# Altium schematic sheet MotorControllerV_Driver1.1.SchDoc
size 889 x 508 mm
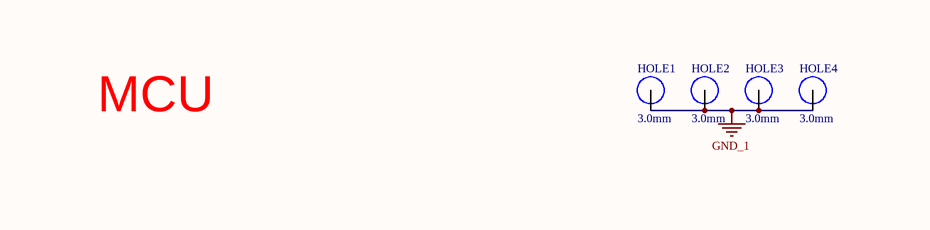
[diagram p0: MotorControllerV_Driver1.1.SchDoc, top left]
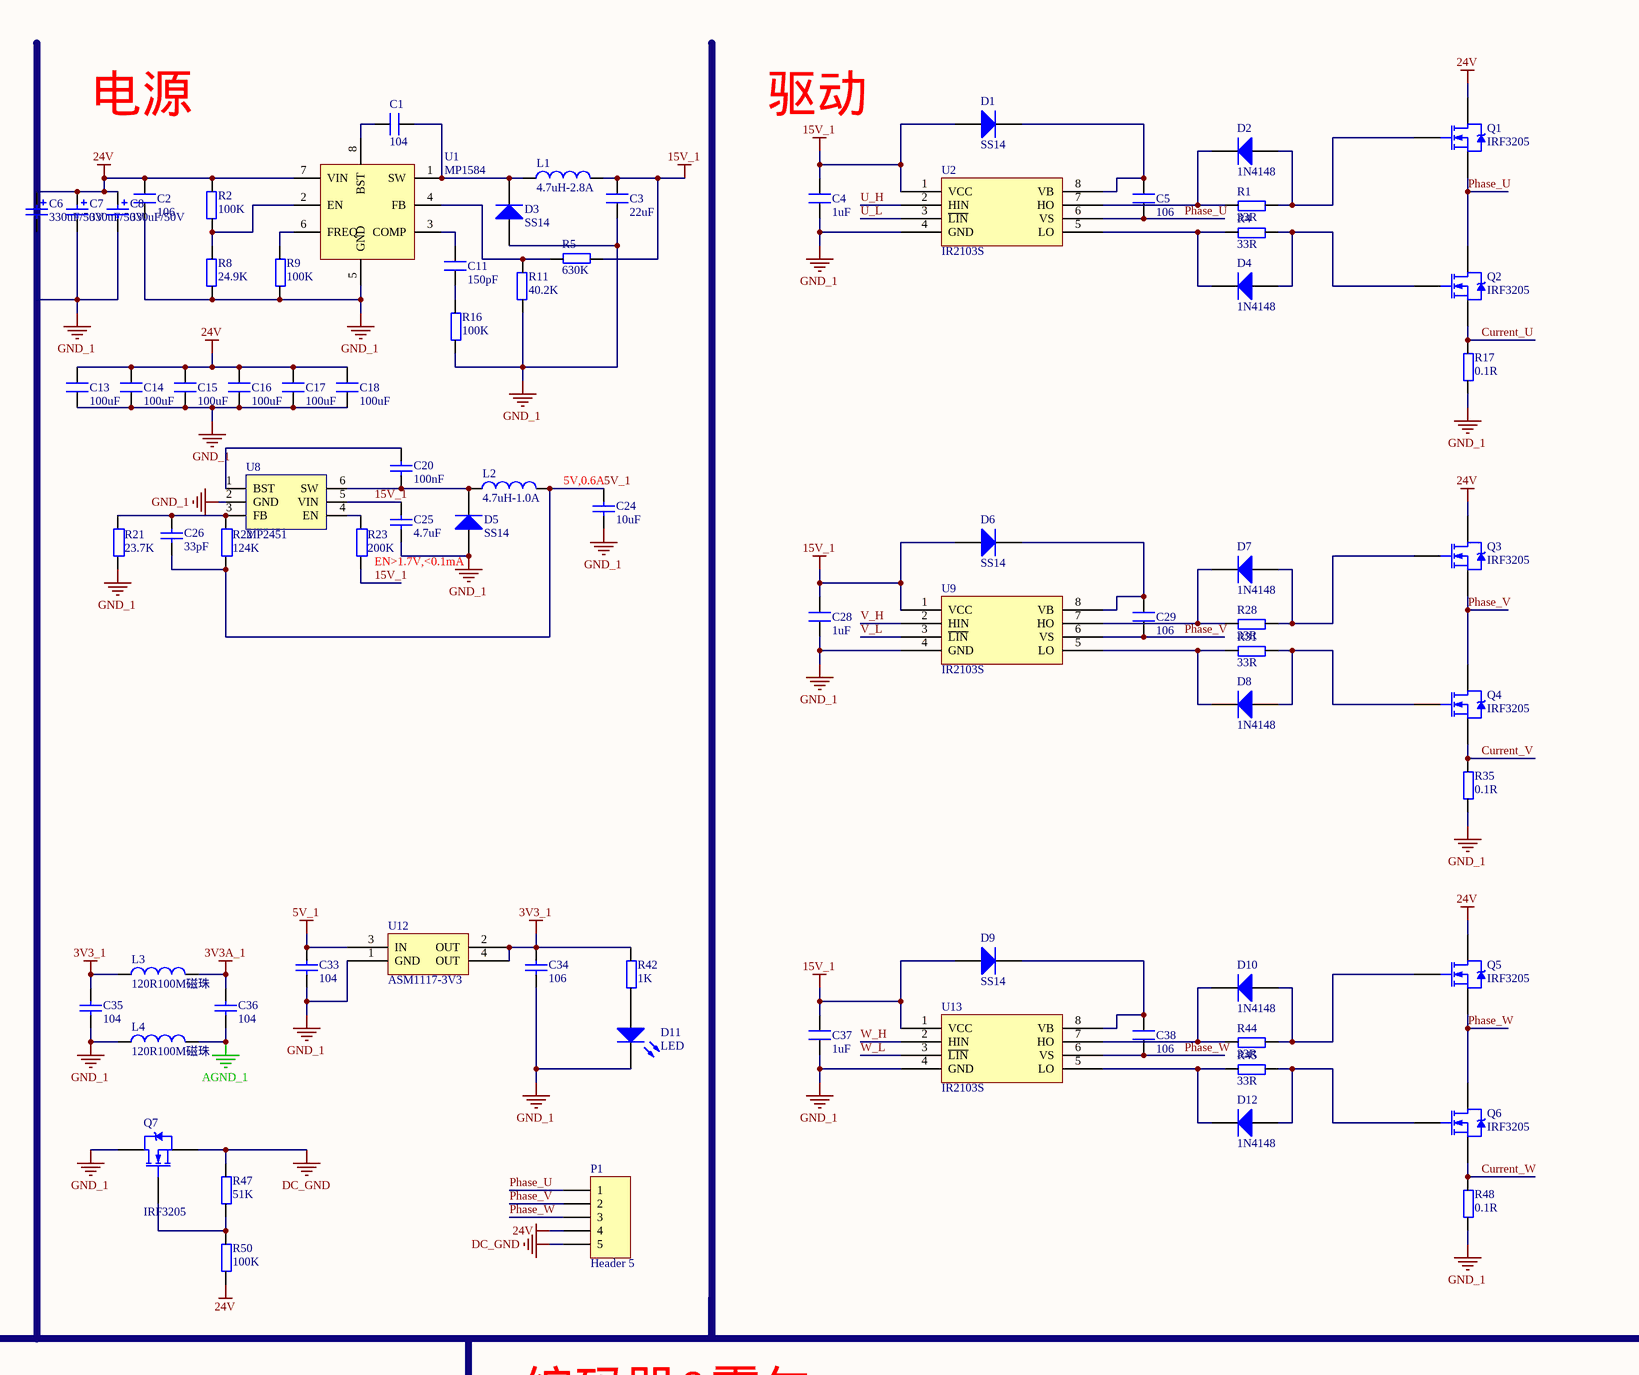
[diagram p1: MotorControllerV_Driver1.1.SchDoc, top middle]
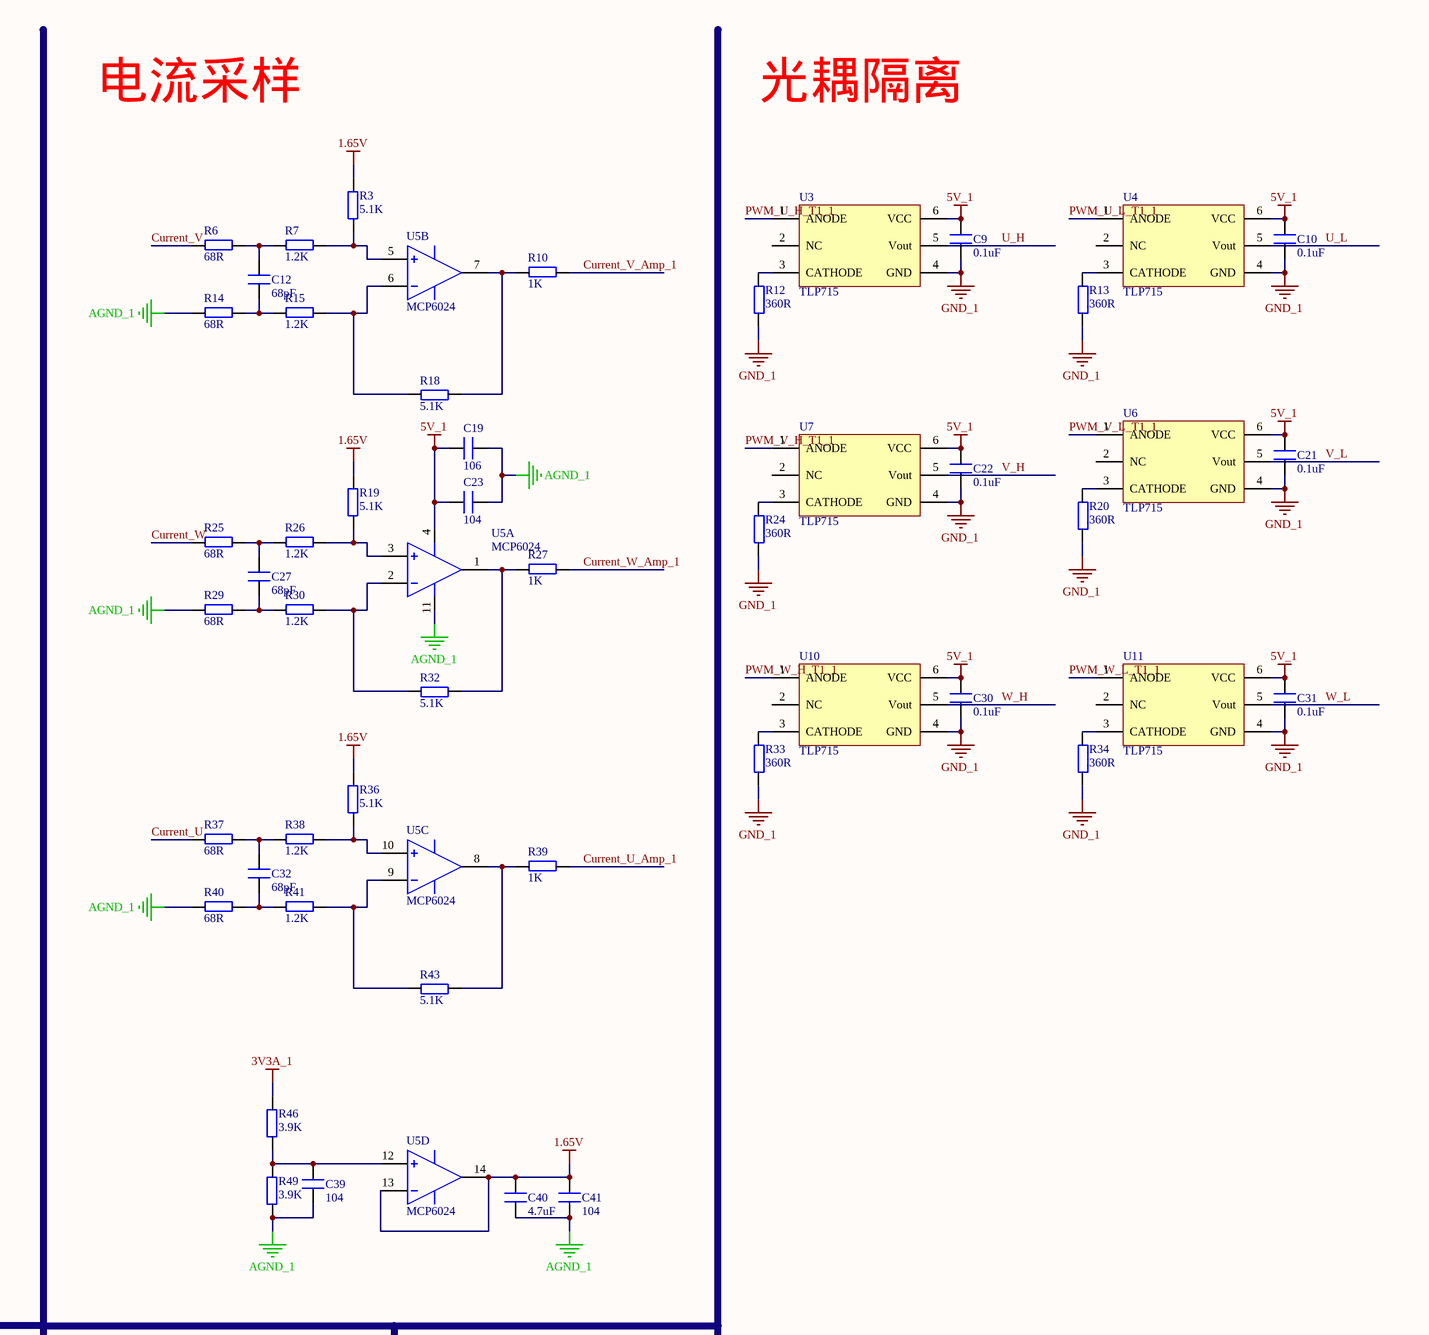
[diagram p2: MotorControllerV_Driver1.1.SchDoc, top right]
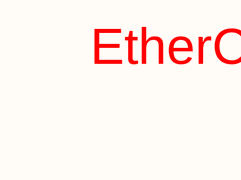
[diagram p3: MotorControllerV_Driver1.1.SchDoc, bottom left]
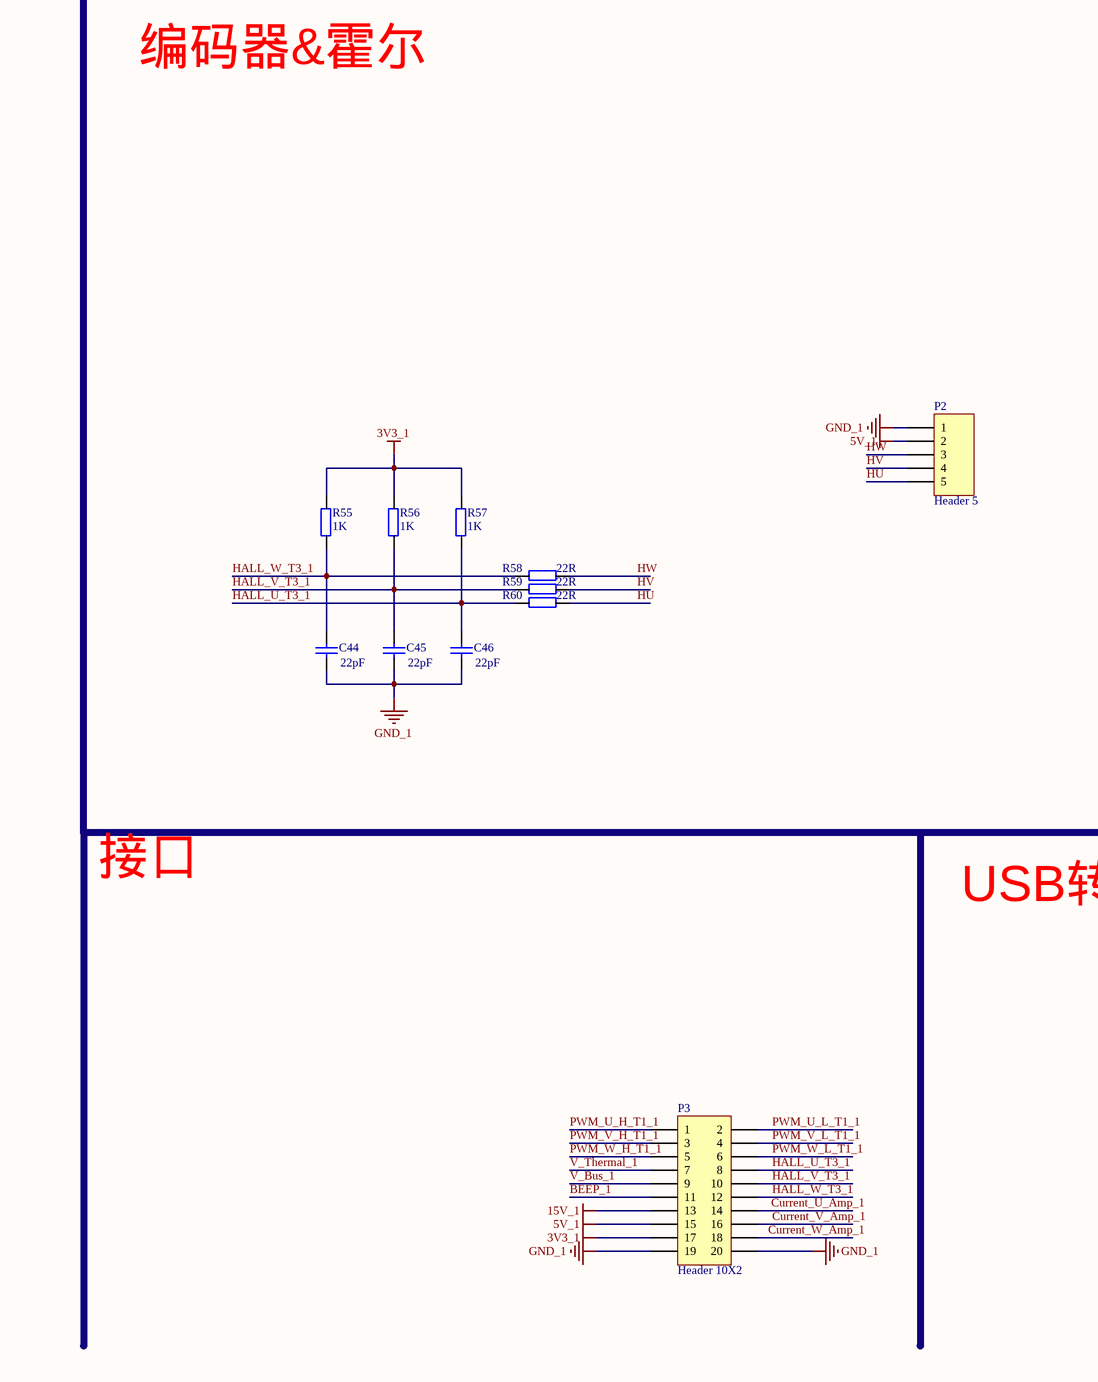
[diagram p4: MotorControllerV_Driver1.1.SchDoc, bottom middle]
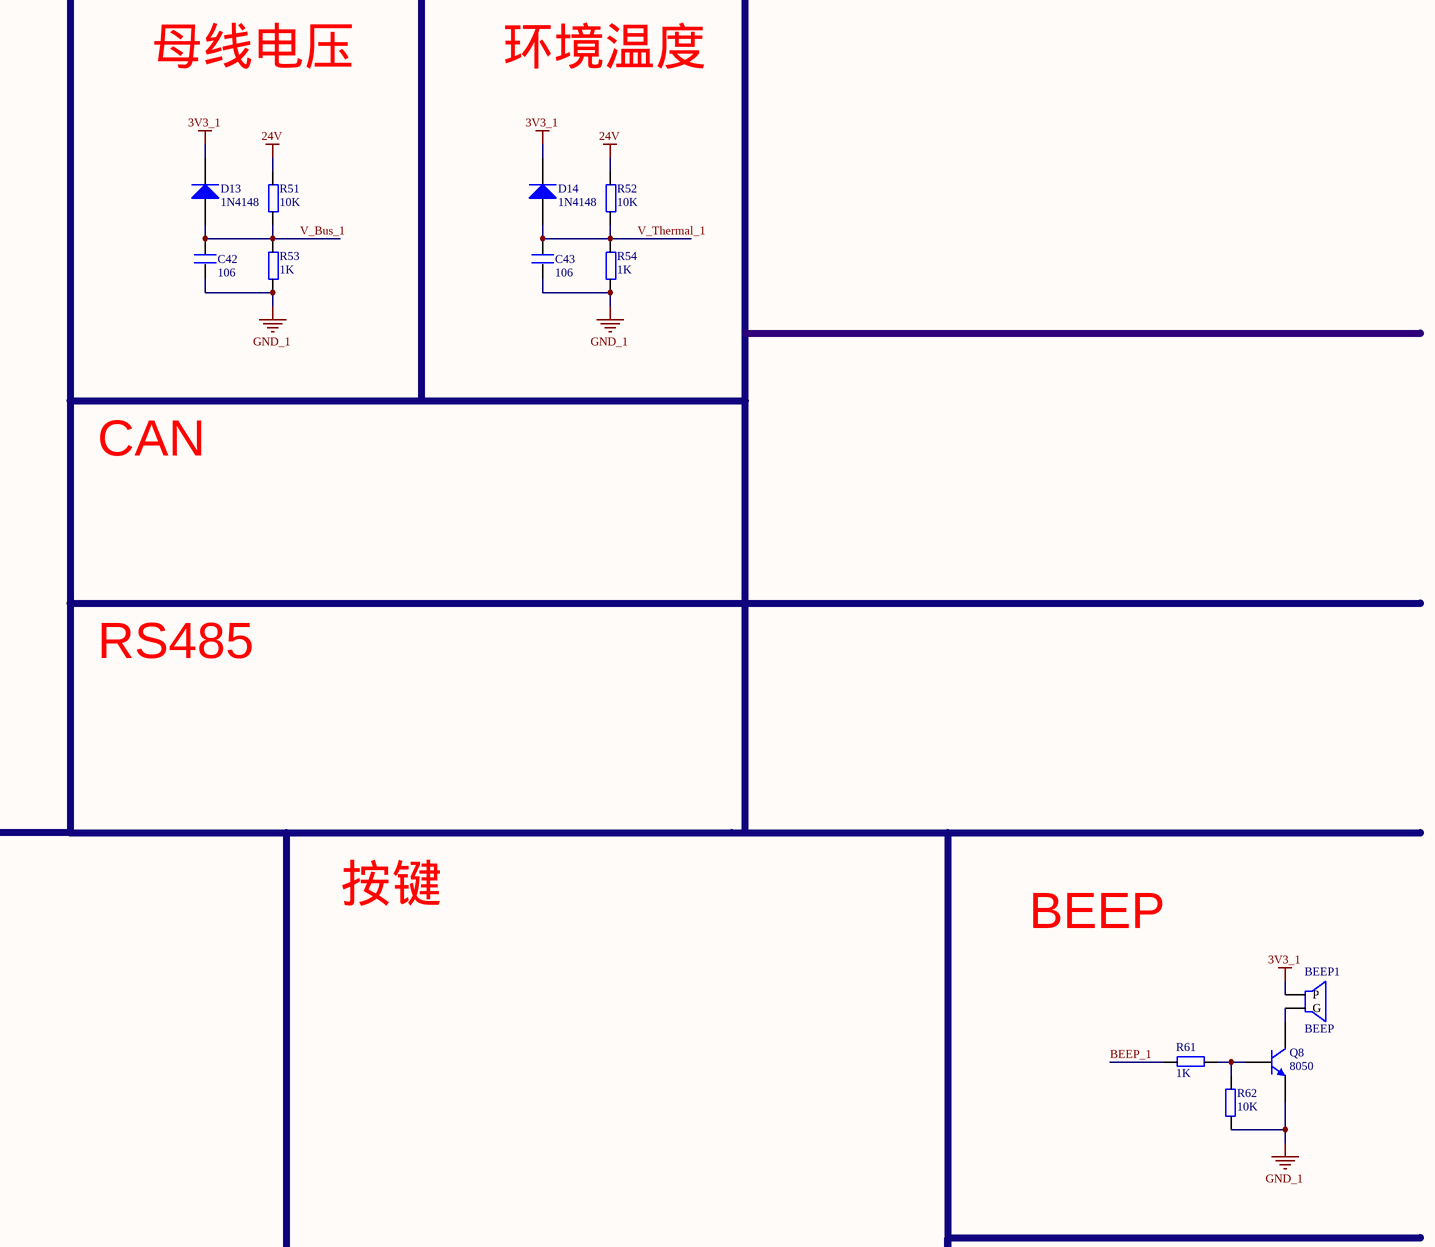
[diagram p5: MotorControllerV_Driver1.1.SchDoc, bottom right]

## Parts
BEEP1  BEEP  [BEEP 5x9x5.5]
C1  104  [0603_C]
C2  106  [0603_C]
C3  22uF  [0603_C]
C4  1uF  [0603_C]
C5  106  [1210_C]
C6  330uF/50V  [CM F(10*10.2)]
C7  330uF/50V  [CM F(10*10.2)]
C8  330uF/50V  [CM F(10*10.2)]
C9  0.1uF  [0603_C]
C10  0.1uF  [0603_C]
C11  150pF  [0603_C]
C12  68pF  [0603_C]
C13  100uF  [1210_C]
C14  100uF  [1210_C]
C15  100uF  [1210_C]
C16  100uF  [1210_C]
C17  100uF  [1210_C]
C18  100uF  [1210_C]
C19  106  [0603_C]
C20  100nF  [0603_C]
C21  0.1uF  [0603_C]
C22  0.1uF  [0603_C]
C23  104  [0603_C]
C24  10uF  [0603_C]
C25  4.7uF  [0603_C]
C26  33pF  [0603_C]
C27  68pF  [0603_C]
C28  1uF  [0603_C]
C29  106  [1210_C]
C30  0.1uF  [0603_C]
C31  0.1uF  [0603_C]
C32  68pF  [0603_C]
C33  104  [0603_C]
C34  106  [0603_C]
C35  104  [0603_C]
C36  104  [0603_C]
C37  1uF  [0603_C]
C38  106  [1210_C]
C39  104  [0603_C]
C40  4.7uF  [0603_C]
C41  104  [0603_C]
C42  106  [0603_C]
C43  106  [0603_C]
C44  22pF  [0603_C]
C45  22pF  [0603_C]
C46  22pF  [0603_C]
D1  SS14  [SOD-323]
D2  1N4148  [SOD-123F]
D3  SS14  [SMA]
D4  1N4148  [SOD-123F]
D5  SS14  [SOD-323]
D6  SS14  [SOD-323]
D7  1N4148  [SOD-123F]
D8  1N4148  [SOD-123F]
D9  SS14  [SOD-323]
D10  1N4148  [SOD-123F]
D11  LED  [0603_LED]
D12  1N4148  [SOD-123F]
D13  1N4148  [SOD-123F]
D14  1N4148  [SOD-123F]
HOLE1  value 3.0mm  [M2.5x6+6_L]  (hidden comment: HOLE)
HOLE2  value 3.0mm  [M2.5x6+6_L]  (hidden comment: HOLE)
HOLE3  value 3.0mm  [M2.5x6+6_L]  (hidden comment: HOLE)
HOLE4  value 3.0mm  [M2.5x6+6_L]  (hidden comment: HOLE)
L1  4.7uH-2.8A  [CDRH74]
L2  4.7uH-1.0A  [CD32]
L3  120R100M磁珠  [0603_R]
L4  120R100M磁珠  [0603_R]
P1  Header 5  [HT5.08-5P]
P2  Header 5  [HDR2.54-WI-5P]
P3  Header 10X2  [HDR2.54-LI-2x10P]
Q1  IRF3205  [TO252]
Q2  IRF3205  [TO252]
Q3  IRF3205  [TO252]
Q4  IRF3205  [TO252]
Q5  IRF3205  [TO252]
Q6  IRF3205  [TO252]
Q7  IRF3205  [TO252]
Q8  8050  [SOT23]
R1  33R  [0603_R]
R2  100K  [0603_R]
R3  5.1K  [0603_R]
R4  33R  [0603_R]
R5  630K  [0603_R]
R6  68R  [0603_R]
R7  1.2K  [0603_R]
R8  24.9K  [0603_R]
R9  100K  [0603_R]
R10  1K  [0603_R]
R11  40.2K  [0603_R]
R12  360R  [0603_R]
R13  360R  [0603_R]
R14  68R  [0603_R]
R15  1.2K  [0603_R]
R16  100K  [0603_R]
R17  0.1R  [R_2512]
R18  5.1K  [0603_R]
R19  5.1K  [0603_R]
R20  360R  [0603_R]
R21  23.7K  [0603_R]
R22  124K  [0603_R]
R23  200K  [0603_R]
R24  360R  [0603_R]
R25  68R  [0603_R]
R26  1.2K  [0603_R]
R27  1K  [0603_R]
R28  33R  [0603_R]
R29  68R  [0603_R]
R30  1.2K  [0603_R]
R31  33R  [0603_R]
R32  5.1K  [0603_R]
R33  360R  [0603_R]
R34  360R  [0603_R]
R35  0.1R  [R_2512]
R36  5.1K  [0603_R]
R37  68R  [0603_R]
R38  1.2K  [0603_R]
R39  1K  [0603_R]
R40  68R  [0603_R]
R41  1.2K  [0603_R]
R42  1K  [0603_R]
R43  5.1K  [0603_R]
R44  33R  [0603_R]
R45  33R  [0603_R]
R46  3.9K  [0603_R]
R47  51K  [0603_R]
R48  0.1R  [R_2512]
R49  3.9K  [0603_R]
R50  100K  [0603_R]
R51  10K  [0603_R]
R52  10K  [Thermistor_MF52]
R53  1K  [0603_R]
R54  1K  [0603_R]
R55  1K  [0603_R]
R56  1K  [0603_R]
R57  1K  [0603_R]
R58  22R  [0603_R]
R59  22R  [0603_R]
R60  22R  [0603_R]
R61  1K  [0603_R]
R62  10K  [0603_R]
U1  MP1584  [SOIC-8E]
U2  IR2103S  [SOP-8]
U3  TLP715  [SOP-6]
U4  TLP715  [SOP-6]
U5  MCP6024  [SOIC-14_150mil]  (parts A,B,C,D of 4)
U6  TLP715  [SOP-6]
U7  TLP715  [SOP-6]
U8  MP2451  [SOT23-6]
U9  IR2103S  [SOP-8]
U10  TLP715  [SOP-6]
U11  TLP715  [SOP-6]
U12  ASM1117-3V3  [SOT-223]
U13  IR2103S  [SOP-8]

## Nets
1.65V: C40.2 C41.2 R3.1 R19.1 R36.1 U5.13(4IN-) U5.14(4OUT)
3V3_1: BEEP1.1(P) C34.2 C35.2 D13.2(K) D14.2(K) L3.1 P3.17 R42.2 R55.1 R56.1 R57.1 U12.2(OUT) U12.4(OUT)
3V3A_1: C36.2 L3.2 R46.1
5V_1: C9.2 C10.2 C19.2 C21.2 C22.2 C23.2 C24.2 C26.2 C30.2 C31.2 C33.2 L2.2 P2.2 P3.15 R22.1 U3.6(VCC) U4.6(VCC) U5.4(VCC) U6.6(VCC) U7.6(VCC) U10.6(VCC) U11.6(VCC) U12.3(IN)
15V_1: C3.1 C4.2 C25.1 C28.2 C37.2 D1.1(A) D6.1(A) D9.1(A) L1.2 P3.13 R5.1 R23.1 U2.1(VCC) U8.5(VIN) U9.1(VCC) U13.1(VCC)
24V: C2.2 C6.1 C7.1 C8.1 C13.2 C14.2 C15.2 C16.2 C17.2 C18.2 P1.4 Q1.2(D) Q3.2(D) Q5.2(D) R2.1 R50.1 R51.2 R52.2 U1.7(VIN)
AGND_1: C19.1 C23.1 C36.1 C39.1 C40.1 C41.1 L4.2 R14.2 R29.2 R40.2 R49.2 U5.11(GND)
DC_GND: P1.5 Q7.3(S) R47.2
GND_1: C2.1 C3.2 C4.1 C6.2 C7.2 C8.2 C9.1 C10.1 C13.1 C14.1 C15.1 C16.1 C17.1 C18.1 C21.1 C22.1 C24.1 C25.2 C28.1 C30.1 C31.1 C33.1 C34.1 C35.1 C37.1 C42.2 C43.2 C44.1 C45.1 C46.1 D3.1(A) D5.1(A) D11.2(K) HOLE1.1 HOLE2.1 HOLE3.1 HOLE4.1 L4.1 P2.1 P3.19 P3.20 Q7.2(D) Q8.2(E) R8.2 R9.1 R11.2 R12.1 R13.1 R16.1 R17.1 R20.1 R21.1 R24.1 R33.1 R34.1 R35.1 R48.1 R53.1 R54.1 R62.2 U1.5(GND) U2.4(GND) U3.4(GND) U4.4(GND) U6.4(GND) U7.4(GND) U8.2(GND) U9.4(GND) U10.4(GND) U11.4(GND) U12.1(GND) U13.4(GND)
BEEP_1: P3.11 R61.2
Current_U: Q2.3(S) R17.2 R37.2
Current_U_Amp_1: P3.14 R39.1
Current_V: Q4.3(S) R6.2 R35.2
Current_V_Amp_1: P3.16 R10.1
Current_W: Q6.3(S) R25.2 R48.2
Current_W_Amp_1: P3.18 R27.1
HALL_U_T3_1: C46.2 P3.8 R57.2 R60.2
HALL_V_T3_1: C45.2 P3.10 R56.2 R59.2
HALL_W_T3_1: C44.2 P3.12 R55.2 R58.2
HU: P2.5 R60.1
HV: P2.4 R59.1
HW: P2.3 R58.1
Phase_U: C5.1 P1.1 Q1.3(S) Q2.2(D) U2.6(VS)
Phase_V: C29.1 P1.2 Q3.3(S) Q4.2(D) U9.6(VS)
Phase_W: C38.1 P1.3 Q5.3(S) Q6.2(D) U13.6(VS)
PWM_U_H_T1_1: P3.1 U3.1(ANODE)
PWM_U_L_T1_1: P3.2 U4.1(ANODE)
PWM_V_H_T1_1: P3.3 U7.1(ANODE)
PWM_V_L_T1_1: P3.4 U6.1(ANODE)
PWM_W_H_T1_1: P3.5 U10.1(ANODE)
PWM_W_L_T1_1: P3.6 U11.1(ANODE)
U_H: U2.2(HIN) U3.5(Vout)
U_L: U2.3(~{LIN}) U4.5(Vout)
V_Bus_1: C42.1 D13.1(A) P3.9 R51.1 R53.2
V_H: U7.5(Vout) U9.2(HIN)
V_L: U6.5(Vout) U9.3(~{LIN})
V_Thermal_1: C43.1 D14.1(A) P3.7 R52.1 R54.2
W_H: U10.5(Vout) U13.2(HIN)
W_L: U11.5(Vout) U13.3(~{LIN})
NetBEEP1_2: BEEP1.2(G) Q8.3(C)
NetC1_1: C1.1 D3.2(K) L1.1 U1.1(SW)
NetC1_2: C1.2 U1.8(BST)
NetC5_2: C5.2 D1.2(K) U2.8(VB)
NetC11_1: C11.1 U1.3(COMP)
NetC11_2: C11.2 R16.2
NetC12_1: C12.1 R14.1 R15.2
NetC12_2: C12.2 R6.1 R7.2
NetC20_1: C20.1 D5.2(K) L2.1 U8.6(SW)
NetC20_2: C20.2 U8.1(BST)
NetC26_1: C26.1 R21.2 R22.2 U8.3(FB)
NetC27_1: C27.1 R29.1 R30.2
NetC27_2: C27.2 R25.1 R26.2
NetC29_2: C29.2 D6.2(K) U9.8(VB)
NetC32_1: C32.1 R40.1 R41.2
NetC32_2: C32.2 R37.1 R38.2
NetC38_2: C38.2 D9.2(K) U13.8(VB)
NetC39_2: C39.2 R46.2 R49.1 U5.12(4IN+)
NetD2_1: D2.1(A) Q1.1(G) R1.2
NetD2_2: D2.2(K) R1.1 U2.7(HO)
NetD4_1: D4.1(A) Q2.1(G) R4.2
NetD4_2: D4.2(K) R4.1 U2.5(LO)
NetD7_1: D7.1(A) Q3.1(G) R28.2
NetD7_2: D7.2(K) R28.1 U9.7(HO)
NetD8_1: D8.1(A) Q4.1(G) R31.2
NetD8_2: D8.2(K) R31.1 U9.5(LO)
NetD10_1: D10.1(A) Q5.1(G) R44.2
NetD10_2: D10.2(K) R44.1 U13.7(HO)
NetD11_1: D11.1(A) R42.1
NetD12_1: D12.1(A) Q6.1(G) R45.2
NetD12_2: D12.2(K) R45.1 U13.5(LO)
NetQ7_1: Q7.1(G) R47.1 R50.2
NetQ8_1: Q8.1(B) R61.1 R62.1
NetR2_2: R2.2 R8.1 U1.2(EN)
NetR3_2: R3.2 R7.1 U5.5(2IN+)
NetR5_2: R5.2 R11.1 U1.4(FB)
NetR9_2: R9.2 U1.6(FREQ)
NetR10_2: R10.2 R18.2 U5.7(2OUT)
NetR12_2: R12.2 U3.3(CATHODE)
NetR13_2: R13.2 U4.3(CATHODE)
NetR15_1: R15.1 R18.1 U5.6(2IN-)
NetR19_2: R19.2 R26.1 U5.3(1IN+)
NetR20_2: R20.2 U6.3(CATHODE)
NetR23_2: R23.2 U8.4(EN)
NetR24_2: R24.2 U7.3(CATHODE)
NetR27_2: R27.2 R32.2 U5.1(1OUT)
NetR30_1: R30.1 R32.1 U5.2(1IN-)
NetR33_2: R33.2 U10.3(CATHODE)
NetR34_2: R34.2 U11.3(CATHODE)
NetR36_2: R36.2 R38.1 U5.10(3IN+)
NetR39_2: R39.2 R43.2 U5.8(3OUT)
NetR41_1: R41.1 R43.1 U5.9(3IN-)

Not connected (* = marked no-connect by the designer): U3 2(NC); U4 2(NC); U6 2(NC); U7 2(NC); U10 2(NC); U11 2(NC)

## Notes on the sheet
- MCU
- 电源
- 驱动
- 电流采样
- 光耦隔离
- (near C24) 5V,0.6A
- (near R23) EN>1.7V,<0.1mA
- EtherCAT
- 编码器&霍尔
- 母线电压
- 环境温度
- CAN
- RS485
- 接口
- USB转串口
- 按键
- BEEP

## Library data of the parts
C1-C5 C9-C19 C21-C23 C27-C32 C37-C43 = C
C6-C8 = C+: Value: 100pF; Published: 8-Jun-2000; LatestRevisionDate: 29-May-2009; LatestRevisionNote: IPC-7351 Footprint Added.; PackageReference: C0805; Publisher: Altium Limited; PackageDescription: Chip Capacitor
C20 C24-C26 C33-C36 = C: Value: 100pF; Published: 8-Jun-2000; LatestRevisionDate: 29-May-2009; LatestRevisionNote: IPC-7351 Footprint Added.; PackageReference: C1206; Publisher: Altium Limited; PackageDescription: Chip Capacitor
C44 C45 = Cap: Capacitor; Published: 8-Jun-2000; LatestRevisionDate: 17-Jul-2002; LatestRevisionNote: Re-released for DXP Platform.; PackageReference: RAD-0.3; Publisher: Altium Limited; PackageDescription: Radial Cap, Thru-Hole; 2 Leads; 0.3 in Pin Spacing; Value: 22pF
C46 = Cap: Capacitor; Value: 104; Published: 8-Jun-2000; LatestRevisionDate: 17-Jul-2002; LatestRevisionNote: Re-released for DXP Platform.; PackageReference: RAD-0.3; Publisher: Altium Limited; PackageDescription: Radial Cap, Thru-Hole; 2 Leads; 0.3 in Pin Spacing
D1-D10 D12-D14 = Dio: D
L1 L2 = L: Code_IEC: 1005; Value: 10mH; Published: 8-Jun-2000; LatestRevisionDate: 29-May-2009; LatestRevisionNote: IPC-7351 Footprint Added.; PackageReference: 0402-A; Publisher: Altium Limited; PackageDescription: Chip Inductor; Code_JEITA: 0402
L3 L4 = L_1: L; Code_IEC: 1005; Value: 10mH; Published: 8-Jun-2000; LatestRevisionDate: 29-May-2009; LatestRevisionNote: IPC-7351 Footprint Added.; PackageReference: 0402-A; Publisher: Altium Limited; PackageDescription: Chip Inductor; Code_JEITA: 0402
P1 P2 = Header 5: Header, 5-Pin; LatestRevisionDate: 17-Jul-2002; LatestRevisionNote: Re-released for DXP Platform.; Publisher: Altium Limited
P3 = Header 10X2: Header, 10-Pin, Dual row; LatestRevisionDate: 17-Jul-2002; LatestRevisionNote: Re-released for DXP Platform.; Publisher: Altium Limited
Q1-Q7 = NMOS-2: N-Channel Power MOSFET; Note: Pin 2 is electrically connected to pin 4.; Published: 8-Jun-2000; LatestRevisionDate: 17-Jul-2002; LatestRevisionNote: Re-released for DXP Platform.; DatasheetVersion: PD-9.814; PackageVersion: Feb-1997; PackageReference: TO-220AB; Publisher: Altium Limited; PackageDescription: TO, Thru-Hole, Vertical, Heatsink Mounted; 3 In-Line Leads; Pitch 2.54 mm; ComponentLink1Description: Manufacturer Link; ComponentLink1URL: http://www.irf.com/
Q8 = NPN_1: NPN Bipolar Transistor; Published: 8-Jun-2000; LatestRevisionDate: 17-Jul-2002; LatestRevisionNote: Re-released for DXP Platform.; PackageReference: TO-226-AA; Publisher: Altium Limited; PackageDescription: TO, Flat Index; 3 In-Line, Axial Leads; Body Dia. 4.8mm; Leads 0.55 x 0.51 mm (max); Code_JEDEC: TO-226-AA
R1-R62 = R
  R21-R23: Published: 8-Jun-2000; LatestRevisionDate: 17-Jul-2002; LatestRevisionNote: Re-released for DXP Platform.; PackageReference: AXIAL-0.4; Publisher: Altium Limited; PackageDescription: Axial Device, Thru-Hole; 2 Leads; 0.4 in Pin Spacing
U12 = ASM1117: 3.3V稳压芯片